# EAGLE schematic 6502_C64_with_m8 (EAGLE 9.2.2)
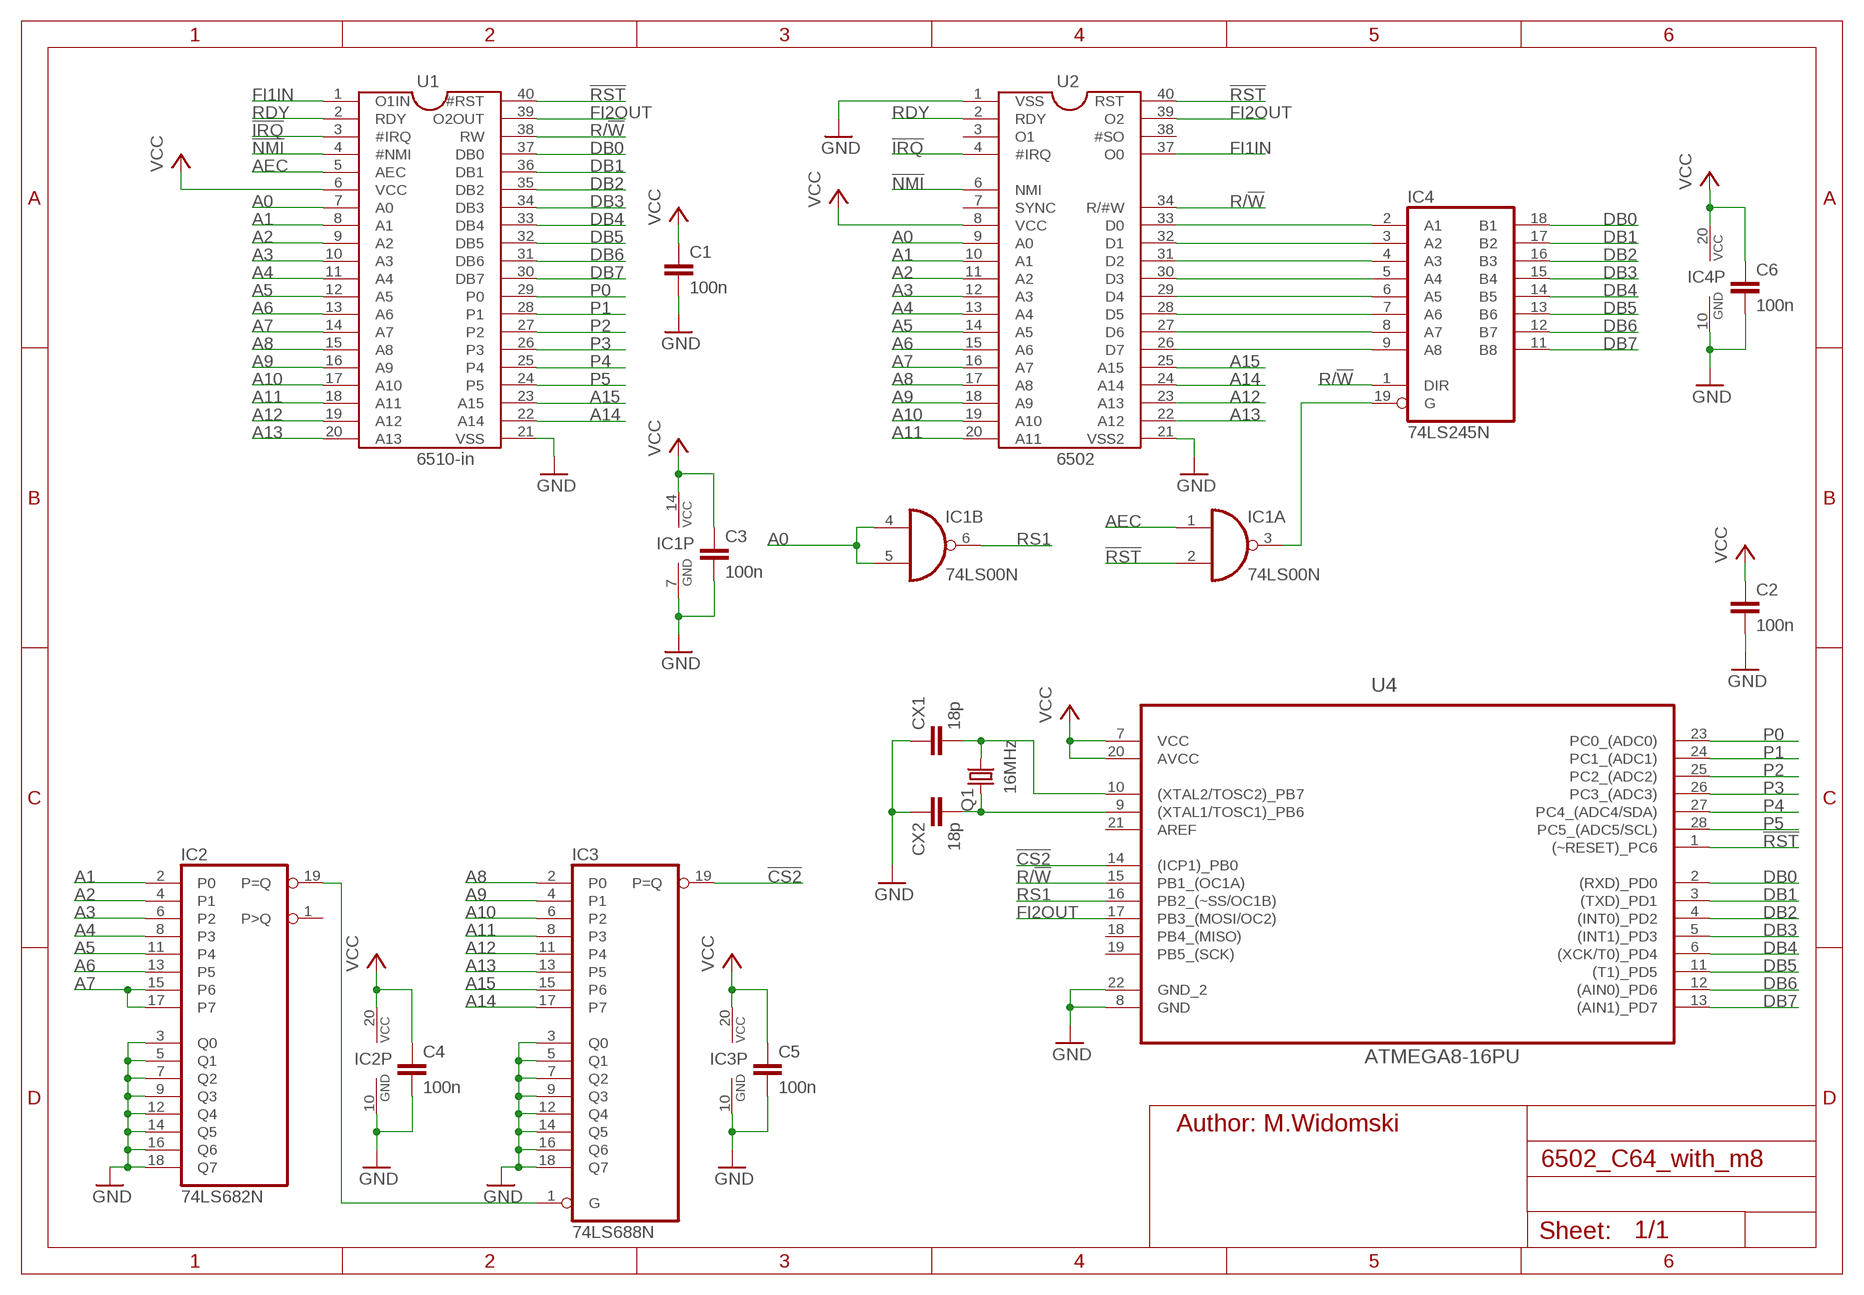
[diagram p0: schematic, sheet 1]

## Parts
C1  100n  C-EU025-025X050  [C025-025X050]
C2  100n  C-EU025-025X050  [C025-025X050]
C3  100n  C-EU025-025X050  [C025-025X050]
C4  100n  C-EU025-025X050  [C025-025X050]
C5  100n  C-EU025-025X050  [C025-025X050]
C6  100n  C-EU025-025X050  [C025-025X050]
CX1  18p  C-EU025-025X050  [C025-025X050]
CX2  18p  C-EU025-025X050  [C025-025X050]
IC1  74LS00N  [DIL14]
IC2  74LS682N  [DIL20]
IC3  74LS688N  [DIL20]
IC4  74LS245N  [DIL20]
Q1  16MHz  CRYSTALHC49S  [HC49/S]
U1  6510-in  6510  [DIL40]
U2  6502  [DIL40]
U4  ATMEGA8-16PU  [DIP254P762X457-28]

## Nets
!CS2: IC3.19(P=Q) U4.14((ICP1)_PB0)
!IRQ: U1.3(#IRQ) U2.4(#IRQ)
!NMI: U1.4(#NMI) U2.6(NMI)
!RST: IC1.2(A:I1) U1.40(#RST) U2.40(RST) U4.1((~RESET)_PC6)
A0: IC1.4(B:I0) IC1.5(B:I1) U1.7(A0) U2.9(A0)
A1: IC2.2(P0) U1.8(A1) U2.10(A1)
A2: IC2.4(P1) U1.9(A2) U2.11(A2)
A3: IC2.6(P2) U1.10(A3) U2.12(A3)
A4: IC2.8(P3) U1.11(A4) U2.13(A4)
A5: IC2.11(P4) U1.12(A5) U2.14(A5)
A6: IC2.13(P5) U1.13(A6) U2.15(A6)
A7: IC2.15(P6) IC2.17(P7) U1.14(A7) U2.16(A7)
A8: IC3.2(P0) U1.15(A8) U2.17(A8)
A9: IC3.4(P1) U1.16(A9) U2.18(A9)
A10: IC3.6(P2) U1.17(A10) U2.19(A10)
A11: IC3.8(P3) U1.18(A11) U2.20(A11)
A12: IC3.11(P4) U1.19(A12) U2.23(A13)
A13: IC3.13(P5) U1.20(A13) U2.22(A12)
A14: IC3.17(P7) U1.22(A14) U2.24(A14)
A15: IC3.15(P6) U1.23(A15) U2.25(A15)
AEC: IC1.1(A:I0) U1.5(AEC)
DB0: IC4.18(B1) U1.37(DB0) U4.2((RXD)_PD0)
DB1: IC4.17(B2) U1.36(DB1) U4.3((TXD)_PD1)
DB2: IC4.16(B3) U1.35(DB2) U4.4((INT0)_PD2)
DB3: IC4.15(B4) U1.34(DB3) U4.5((INT1)_PD3)
DB4: IC4.14(B5) U1.33(DB4) U4.6((XCK/T0)_PD4)
DB5: IC4.13(B6) U1.32(DB5) U4.11((T1)_PD5)
DB6: IC4.12(B7) U1.31(DB6) U4.12((AIN0)_PD6)
DB7: IC4.11(B8) U1.30(DB7) U4.13((AIN1)_PD7)
FI1IN: U1.1(O1IN) U2.37(O0)
FI2OUT: U1.39(O2OUT) U2.39(O2) U4.17(PB3_(MOSI/OC2))
GND: C1.2 C2.2 C3.2 C4.2 C5.2 C6.2 CX1.1 CX2.2 IC1.7(P:GND) IC2.3(Q0) IC2.5(Q1) IC2.7(Q2) IC2.9(Q3) IC2.10(GND) IC2.12(Q4) IC2.14(Q5) IC2.16(Q6) IC2.18(Q7) IC3.3(Q0) IC3.5(Q1) IC3.7(Q2) IC3.9(Q3) IC3.10(GND) IC3.12(Q4) IC3.14(Q5) IC3.16(Q6) IC3.18(Q7) IC4.10(GND) U1.21(VSS) U2.1(VSS) U2.21(VSS2) U4.8(GND) U4.22(GND_2)
N$1: IC4.2(A1) U2.33(D0)
N$2: IC4.3(A2) U2.32(D1)
N$3: IC4.4(A3) U2.31(D2)
N$4: IC4.5(A4) U2.30(D3)
N$5: IC4.6(A5) U2.29(D4)
N$6: IC4.7(A6) U2.28(D5)
N$7: IC4.8(A7) U2.27(D6)
N$8: IC4.9(A8) U2.26(D7)
N$9: IC1.3(A:O) IC4.19(G)
N$10: IC2.19(P=Q) IC3.1(G)
N$12: CX1.2 Q1.2 U4.10((XTAL2/TOSC2)_PB7)
N$13: CX2.1 Q1.1 U4.9((XTAL1/TOSC1)_PB6)
P0: U1.29(P0) U4.23(PC0_(ADC0))
P1: U1.28(P1) U4.24(PC1_(ADC1))
P2: U1.27(P2) U4.25(PC2_(ADC2))
P3: U1.26(P3) U4.26(PC3_(ADC3))
P4: U1.25(P4) U4.27(PC4_(ADC4/SDA))
P5: U1.24(P5) U4.28(PC5_(ADC5/SCL))
R/!W: IC4.1(DIR) U1.38(RW) U2.34(R/#W) U4.15(PB1_(OC1A))
RDY: U1.2(RDY) U2.2(RDY)
RS1: IC1.6(B:O) U4.16(PB2_(~SS/OC1B))
VCC: C1.1 C2.1 C3.1 C4.1 C5.1 C6.1 IC1.14(P:VCC) IC2.20(VCC) IC3.20(VCC) IC4.20(VCC) U1.6(VCC) U2.8(VCC) U4.7(VCC) U4.20(AVCC)
Unconnected: IC1.8(C:O) IC1.9(C:I0) IC1.10(C:I1) IC1.11(D:O) IC1.12(D:I0) IC1.13(D:I1) IC2.1(P>Q) U2.3(O1) U2.7(SYNC) U2.38(#SO) U4.18(PB4_(MISO)) U4.19(PB5_(SCK)) U4.21(AREF)

## Notes on the sheet
- Author: M.Widomski

## Library data of the parts
C1-C6 CX1 CX2 = rcl:C-EU: CAPACITOR, European symbol; SPICEPREFIX: C
IC1 = 74xx-eu:74*00: Quad 2-input NAND gate
IC2 = 74xx-eu:74*682: 8-bit MAGNITUDE/IDENTITY COMPARATOR, totem pole
IC3 = 74xx-eu:74*688: 8-bit MAGNITUDE/IDENTITY COMPARATOR, totem pole
IC4 = 74xx-eu:74*245: Octal BUS TRANSCEIVER, 3-state
Q1 = crystal:CRYSTAL: CRYSTAL; OC_FARNELL: 1667008; OC_NEWARK: unknown
U1 = commodore:6510: The famous 6510 CPU. There are some differences between the 6510, 6510-1 and the 6510-2. The -1 and -2 versions have a slightly changed pinout and 2 IO-bits more than the 6510!
U2 = commodore:6502: 6502 MPU * DIP40 package * 65k addressable bytes of memory (A0-A15) * #IRQ and #NMI interrupts * On-Chip clock with TTL single phase input, RC and crystal time base input * Two Phase Clock output * SYNC-Signal * RDY-Signal Information is taken from "Commodore Semiconductor Group - NMOS 6502 MICROPROCESSORS NOVEMBER 1985".
U4 = Atmel_By_element14_Batch_1-00:ATMEGA8-16PU: Programmable Flash; DESCRIPTION: Programmable Flash; MPN: ATMEGA8-16PU; OC_FARNELL: 9171380; OC_NEWARK: 01M6901; PACKAGE: PCDIP-28; SUPPLIER: ATMEL